# EAGLE design Papra v0.5 (EAGLE 9.6.2)
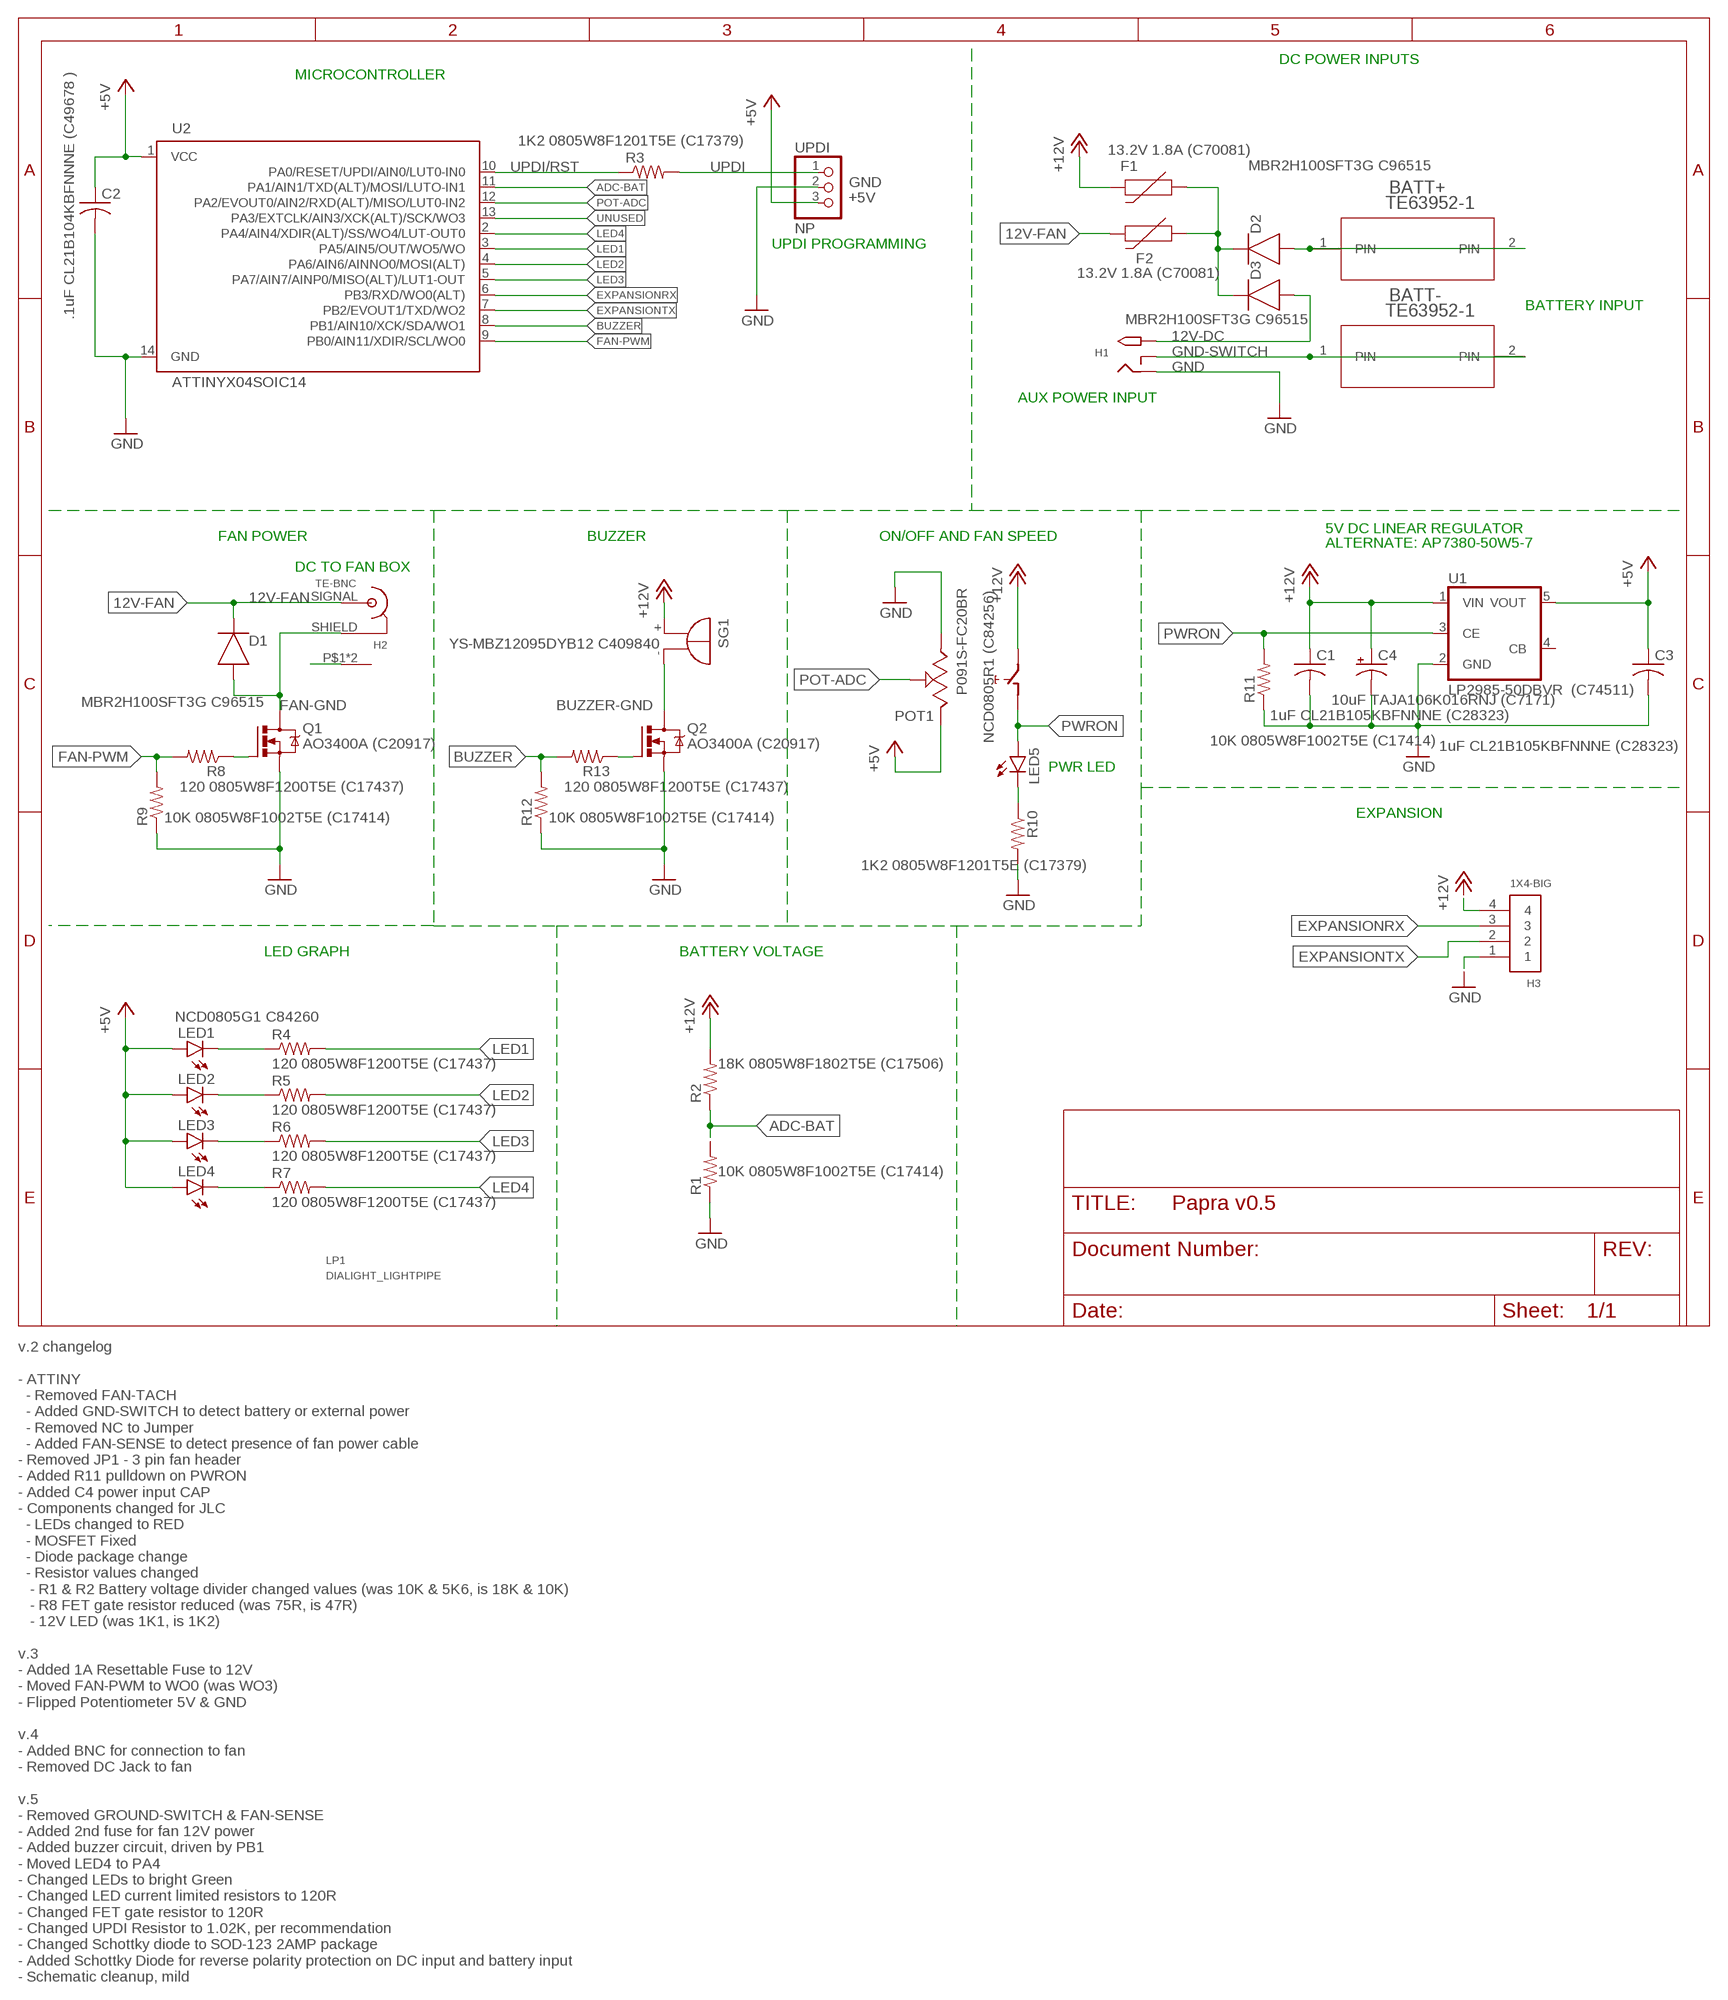
[diagram p0: schematic, sheet 1]

## Parts
BATT+  TE63952-1  [TE63952-1]
BATT-  TE63952-1  [TE63952-1]
C1  1uF CL21B105KBFNNNE (C28323)  C-USC0805  [C0805]
C2  .1uF CL21B104KBFNNNE (C49678 )  C-USC0805  [C0805]
C3  1uF CL21B105KBFNNNE (C28323)  C-USC0805  [C0805]
C4  10uF TAJA106K016RNJ (C7171)  CPOL-USA/3216-18R  [A/3216-18R]
D1  MBR2H100SFT3G C96515  DIODE_DO-219-AB(SOD123F)  [SODFL3718X115]
D2  MBR2H100SFT3G C96515  DIODE_DO-219-AB(SOD123F)  [SODFL3718X115]
D3  MBR2H100SFT3G C96515  DIODE_DO-219-AB(SOD123F)  [SODFL3718X115]
F1  13.2V 1.8A (C70081)  PPTC_HALF-AMP  [1206]
F2  13.2V 1.8A (C70081)  PPTC_HALF-AMP  [1206]
H1  M-CUI-PJ-066A  PJ-066A  [DCJACK-PJ-066A]
H2  TE-BNC  [TE-BNC]
H3  1X4-BIG  [1X04-BIG]
LED1  NCD0805G1 C84260  LEDCHIPLED_0805  [CHIPLED_0805]
LED2  NCD0805G1 C84260  LEDCHIPLED_0805  [CHIPLED_0805]
LED3  NCD0805G1 C84260  LEDCHIPLED_0805  [CHIPLED_0805]
LED4  NCD0805G1 C84260  LEDCHIPLED_0805  [CHIPLED_0805]
LED5  NCD0805R1 (C84256)  LEDCHIPLED_0805  [CHIPLED_0805]
LP1  DIALIGHT_LIGHTPIPE  [DIALIGHT_5151020F_/LEDS]
POT1  P091S-FC20BR  [P091S-FC20BR]
Q1  AO3400A (C20917)  NMOSFET_BSS123-SOT23  [SOT23]
Q2  AO3400A (C20917)  NMOSFET_BSS123-SOT23  [SOT23]
R1  10K 0805W8F1002T5E (C17414)  R-US_R0805  [R0805]
R2  18K 0805W8F1802T5E (C17506)  R-US_R0805  [R0805]
R3  1K2 0805W8F1201T5E (C17379)  R-US_R0805  [R0805]
R4  120 0805W8F1200T5E (C17437)  R-US_R0805  [R0805]
R5  120 0805W8F1200T5E (C17437)  R-US_R0805  [R0805]
R6  120 0805W8F1200T5E (C17437)  R-US_R0805  [R0805]
R7  120 0805W8F1200T5E (C17437)  R-US_R0805  [R0805]
R8  120 0805W8F1200T5E (C17437)  R-US_R0805  [R0805]
R9  10K 0805W8F1002T5E (C17414)  R-US_R0805  [R0805]
R10  1K2 0805W8F1201T5E (C17379)  R-US_R0805  [R0805]
R11  10K 0805W8F1002T5E (C17414)  R-US_R0805  [R0805]
R12  10K 0805W8F1002T5E (C17414)  R-US_R0805  [R0805]
R13  120 0805W8F1200T5E (C17437)  R-US_R0805  [R0805]
SG1  YS-MBZ12095DYB12 C409840  F/TMB  [F/TMB]
U1  LP2985-50DBVR (C74511)  TS520533  [SOT25]
U2  ATTINYX04SOIC14  [SOIC127P600X144-14]
UPDI  NP  PINHD-1X3  [1X03]

## Nets
12V-BAT [RAIL]: BATT+.1(PIN) BATT+.2(PIN) D2.2(A)
12V-DC [RAIL]: D3.2(A) H1.PWR(TIP)
12V-DIODEOR [RAIL]: D2.1(C) D3.1(C) F1.1 F2.1
12V-FAN: D1.1(C) F2.2 H2.SIGNAL(P1)
+5V [RAIL]: C2.1 C3.1 LED1.A LED2.A LED3.A LED4.A POT1.3 U1.5(VOUT) U2.1(VCC) UPDI.3
+12V [RAIL]: C1.1 C4.+ F1.2 H3.4 POT1.NO R2.2 SG1.+ U1.1(VIN)
ADC-BAT: R1.2 R2.1 U2.11(PA1/AIN1/TXD(ALT)/MOSI/LUTO-IN1)
BUZZER: R12.2 R13.2 U2.8(PB1/AIN10/XCK/SDA/WO1)
BUZZER-GND [RAIL]: Q2.3(D) SG1.-
EXPANSIONRX: H3.3 U2.6(PB3/RXD/WO0(ALT))
EXPANSIONTX: H3.2 U2.7(PB2/EVOUT1/TXD/WO2)
FAN-GND [RAIL]: D1.2(A) H2.SHIELD(P2) Q1.3(D)
FAN-PWM: R8.2 R9.2 U2.9(PB0/AIN11/XDIR/SCL/WO0)
FETGATE: Q1.1(G) R8.1
FETGATE1: Q2.1(G) R13.1
GND: C1.2 C2.2 C3.2 C4.- H1.GND(RING) H3.1 POT1.1 Q1.2(S) Q2.2(S) R1.1 R9.1 R10.2 R11.1 R12.1 U1.2(GND) U2.14(GND) UPDI.2
GND-SWITCH: BATT-.1(PIN) BATT-.2(PIN) H1.GNDBREAK(RING_SW)
LED1: R4.2 U2.3(PA5/AIN5/OUT/WO5/WO)
LED1-R: LED1.C R4.1
LED2: R5.2 U2.4(PA6/AIN6/AINNO0/MOSI(ALT))
LED2-R: LED2.C R5.1
LED3: R6.2 U2.5(PA7/AIN7/AINP0/MISO(ALT)/LUT1-OUT)
LED3-R: LED3.C R6.1
LED4: R7.2 U2.2(PA4/AIN4/XDIR(ALT)/SS/WO4/LUT-OUT0)
LED4-R: LED4.C R7.1
LED5-R: LED5.C R10.1
PINS: H2.P$1(P3) H2.P$2(P3)
POT-ADC: POT1.2 U2.12(PA2/EVOUT0/AIN2/RXD(ALT)/MISO/LUT0-IN2)
PWRON: LED5.A POT1.COM R11.2 U1.3(CE)
UNUSED: U2.13(PA3/EXTCLK/AIN3/XCK(ALT)/SCK/WO3)
UPDI: R3.2 UPDI.1
UPDI/RST: R3.1 U2.10(PA0/RESET/UPDI/AIN0/LUT0-IN0)
Unconnected: U1.4(CB)

## Notes on the sheet
- DC POWER INPUTS
- MICROCONTROLLER
- UPDI PROGRAMMING
- BATTERY INPUT
- AUX POWER INPUT
- 5V DC LINEAR REGULATOR
- FAN POWER | BUZZER | ON/OFF AND FAN SPEED
- ALTERNATE: AP7380-50W5-7
- DC TO FAN BOX
- PWR LED
- EXPANSION
- LED GRAPH | BATTERY VOLTAGE
- v.2 changelog
  
  - ATTINY 
    - Removed FAN-TACH
    - Added GND-SWITCH to detect battery or external power
    - Removed NC to Jumper
    - Added FAN-SENSE to detect presence of fan power cable
  - Removed JP1 - 3 pin fan header
  - Added R11 pulldown on PWRON
  - Added C4 power input CAP 
  - Components changed for JLC
    - LEDs changed to RED
    - MOSFET Fixed
    - Diode package change
    - Resistor values changed
     - R1 & R2 Battery voltage divider changed values (was 10K & 5K6, is 18K & 10K)
     - R8 FET gate resistor reduced (was 75R, is 47R)
     - 12V LED (was 1K1, is 1K2)
  
  v.3
  - Added 1A Resettable Fuse to 12V
  - Moved FAN-PWM to WO0 (was WO3)
  - Flipped Potentiometer 5V & GND
  
  v.4 
  - Added BNC for connection to fan
  - Removed DC Jack to fan
  
  v.5
  - Removed GROUND-SWITCH & FAN-SENSE
  - Added 2nd fuse for fan 12V power
  - Added buzzer circuit, driven by PB1
  - Moved LED4 to PA4
  - Changed LEDs to bright Green
  - Changed LED current limited resistors to 120R
  - Changed FET gate resistor to 120R
  - Changed UPDI Resistor to 1.02K, per recommendation
  - Changed Schottky diode to SOD-123 2AMP package
  - Added Schottky Diode for reverse polarity protection on DC input and battery input
  - Schematic cleanup, mild

## Library data of the parts
BATT+ BATT- = PC-LIB:TE63952-1
C1-C3 = rcl:C-US: CAPACITOR, American symbol; SPICEPREFIX: C
C4 = rcl:CPOL-US: POLARIZED CAPACITOR, American symbol; SPICEPREFIX: C
D1-D3 = Diode:DIODE: Diode Rectifier - Generic; CATEGORY: Diode; SUB-CATEGORY: Rectifier; VALUE: DIODE
F1 F2 = SparkFun-Fuses:PPTC: Resettable Fuse PPTC Resettable Fuse. Really a sort of resistor with a polymeric positive temperature coefficient whose resistance increases dramatically with an increase in temperature. When heated by the power passing through the resistance rises causing the current to be limited, protecting the circuit. This is achieved by the transition of the polymer from a crystalline to an amorphous state where the conductive carbon separates breaking the conductive pathways found in the cool crystalline structure. When a PPTC cools back down it resumes conducting letting the circuit turn back on. SparkFun Products: SparkFun RedBoard - Programmed with Arduino <https://www.sparkfun.com/products/12757> Pro Micro - 5V/16MHz <https://www.sparkfun.com/products/12640> Arduino Pro 328 - 5V/16MHz <https://www.sparkfun.com/products/10915> MP3 Trigger <https://www.sparkfun.com/products/13720>; PROD_ID: RES-08585; VALUE: 6V/0.5A
H1 = PC-LIB:PJ-066A
H2 = PC-LIB:TE-BNC: https://www.te.com/usa-en/product-1-1478032-0.html
H3 = adafruit:1X4: 4-pin connector
LED1-LED5 = led:LED: LED OSRAM: - CHIPLED LG R971, LG N971, LY N971, LG Q971, LY Q971, LO R971, LY R971 LH N974, LH R974 LS Q976, LO Q976, LY Q976 LO Q996 - Hyper CHIPLED LW Q18S LB Q993, LB Q99A, LB R99A - SideLED LS A670, LO A670, LY A670, LG A670, LP A670 LB A673, LV A673, LT A673, LW A673 LH A674 LY A675 LS A676, LA A676, LO A676, LY A676, LW A676 LS A679, LY A679, LG A679 - Hyper Micro SIDELED® LS Y876, LA Y876, LO Y876, LY Y876 LT Y87S - SmartLED LW L88C, LW L88S LB L89C, LB L89S, LG L890 LS L89K, LO L89K, LY L89K LS L896, LA L896, LO L896, LY L896 - TOPLED LS T670, LO T670, LY T670, LG T670, LP T670 LSG T670, LSP T670, LSY T670, LOP T670, LYG T670 LG T671, LOG T671, LSG T671 LB T673, LV T673, LT T673, LW T673 LH T674 LS T676, LA T676, LO T676, LY T676, LB T676, LH T676, LSB T676, LW T676 LB T67C, LV T67C, LT T67C, LS T67K, LO T67K, LY T67K, LW E67C LS E67B, LA E67B, LO E67B, LY E67B, LB E67C, LV E67C, LT E67C LW T67C LS T679, LY T679, LG T679 LS T770, LO T770, LY T770, LG T770, LP T770 LB T773, LV T773, LT T773, LW T773 LH T774 LS E675, LA E675, LY E675, LS T675 LS T776, LA T776, LO T776, LY T776, LB T776 LHGB T686 LT T68C, LB T68C - Hyper Mini TOPLED® LB M676 - Mini TOPLED Santana® LG M470 LS M47K, LO M47K, LY M47K Source: http://www.osram.convergy.de LUXEON: - LUMILED® LXK2-PW12-R00, LXK2-PW12-S00, LXK2-PW14-U00, LXK2-PW14-V00 LXK2-PM12-R00, LXK2-PM12-S00, LXK2-PM14-U00 LXK2-PE12-Q00, LXK2-PE12-R00, LXK2-PE12-S00, LXK2-PE14-T00, LXK2-PE14-U00 LXK2-PB12-K00, LXK2-PB12-L00, LXK2-PB12-M00, LXK2-PB14-N00, LXK2-PB14-P00, LXK2-PB14-Q00 LXK2-PR12-L00, LXK2-PR12-M00, LXK2-PR14-Q00, LXK2-PR14-R00 LXK2-PD12-Q00, LXK2-PD12-R00, LXK2-PD12-S00 LXK2-PH12-R00, LXK2-PH12-S00 LXK2-PL12-P00, LXK2-PL12-Q00, LXK2-PL12-R00 Source: www.luxeon.com KINGBRIGHT: KA-3528ASYC Source: www.kingbright.com
LP1 = PC-LIB:DIALIGHT_LIGHTPIPE: DIALIGHT QUAD LIGHTPIPE 515-1020 WITH 0805LEDS
POT1 = PC-LIB:P091S-FC20BR: TT P091S-FC20BR10K
Q1 Q2 = Transistor:NMOSFET_: N-Channel MOSFET - Popular parts; CATEGORY: Transistor; DESCRIPTION: MOSFET N-CH 100V 0.17A SOT-23; DRAIN_CURRENT: 170mA; MANUFACTURER: ON Semiconductor; MPN: BSS123L; OPERATING_TEMP: -55°C ~ 150°C; PART_STATUS: Active; ROHS_COMPLIANT: Yes; SUB-CATEGORY: MOSFET; THERMALLOSS: 360mW; TYPE: N-Channel; VALUE: BSS123
R1-R13 = rcl:R-US_: RESISTOR, American symbol; SPICEPREFIX: R
SG1 = buzzer:F/TMB: BUZZER Source: Buerklin; OC_FARNELL: unknown; OC_NEWARK: unknown
U1 = v-reg:TS5205: 150mA Low Noise LDO Voltage Regulator with Enable TSC [Taiwan Semiconductor Company, Ltd] Source: http://www.taiwansemi.com .. 5205_0409c.pdf
U2 = PC-LIB:ATTINYX04
UPDI = adafruit:PINHD-1X3: PIN HEADER

## Net classes
0 default: width 0.254 mm, clearance 0.203 mm
1 RAIL: width 0.508 mm, clearance 0.254 mm

## Board
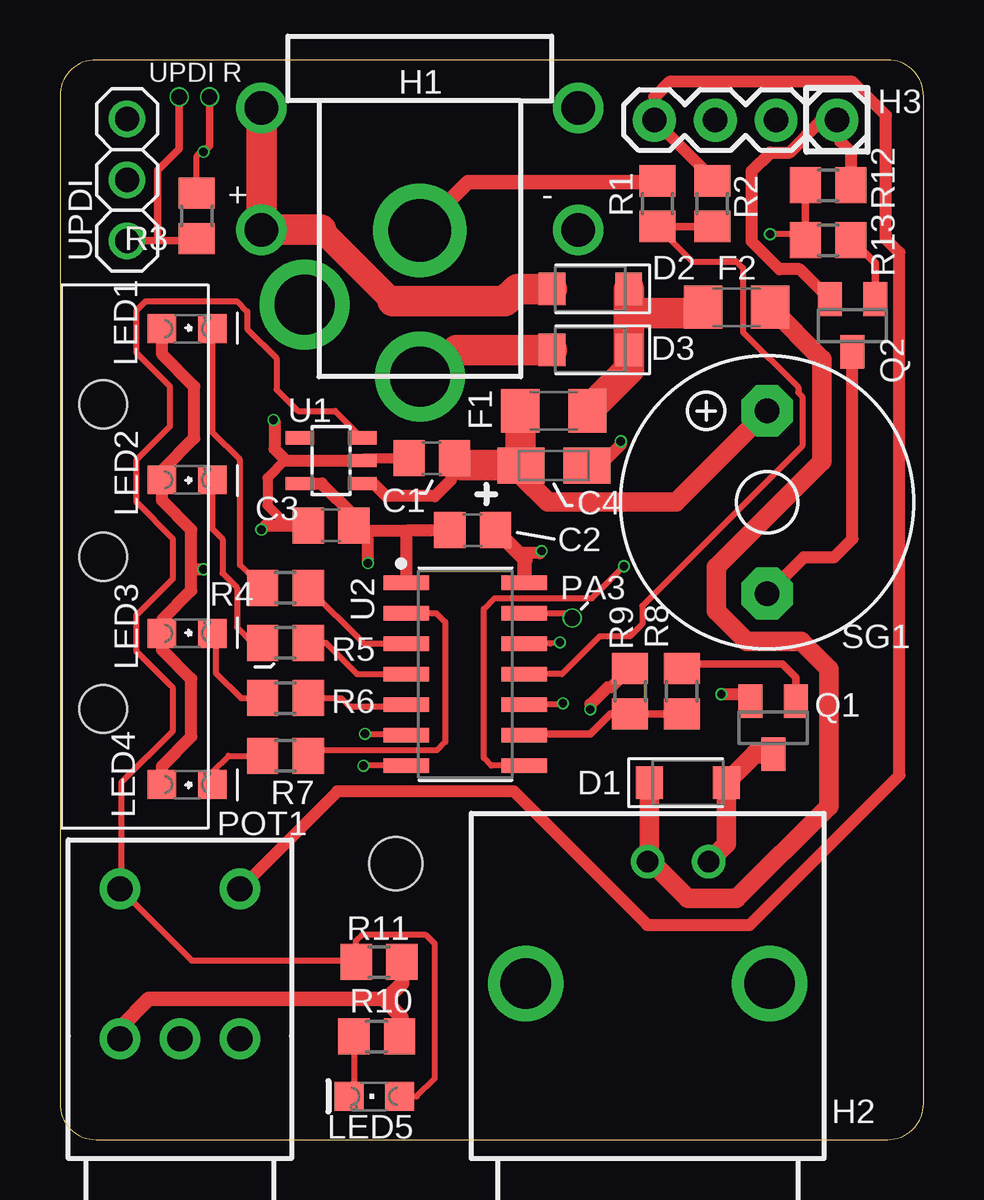
[diagram p1: board, top side]
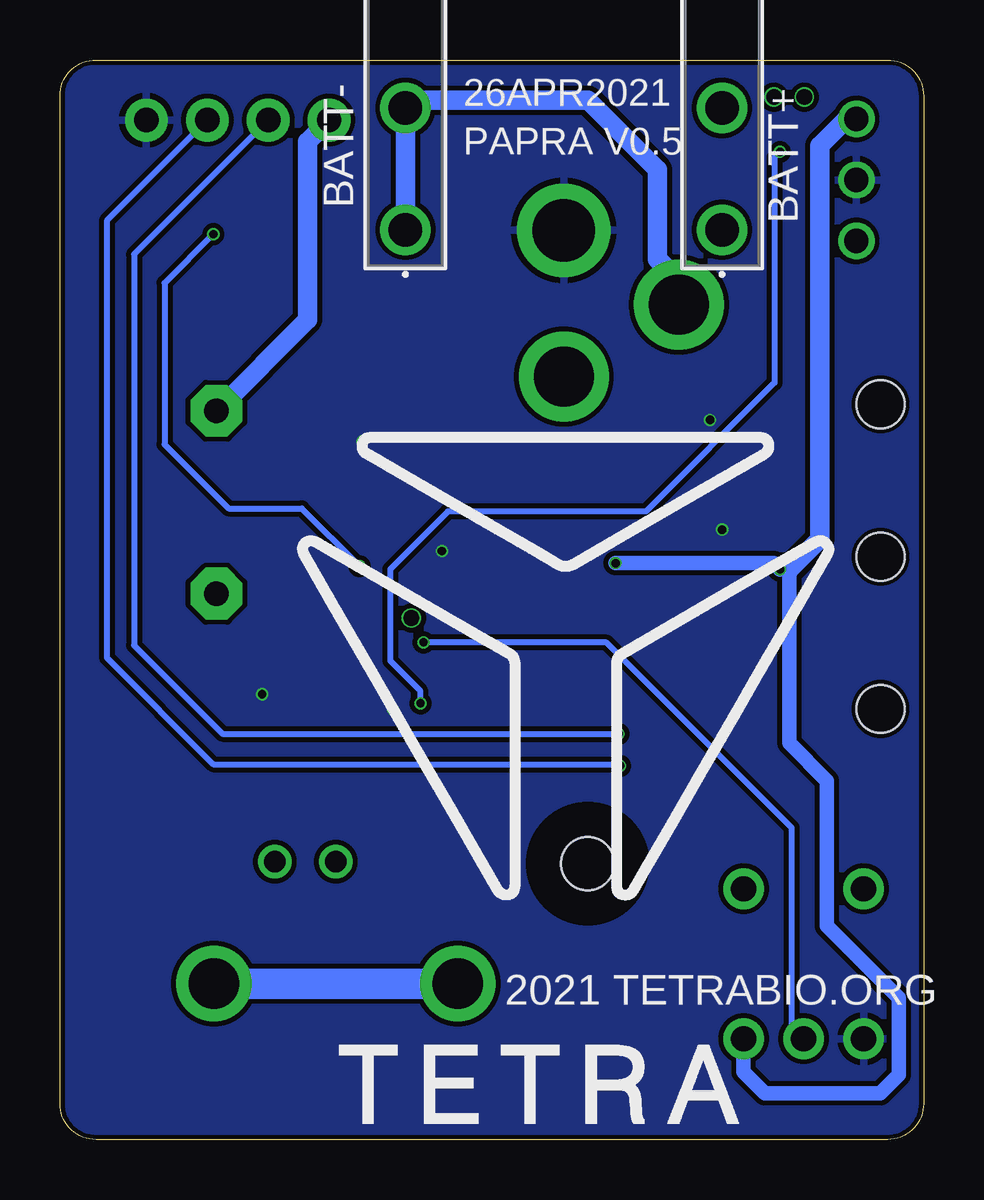
[diagram p2: board, bottom side, seen from below]

Size 36 x 45 mm. Coordinates in mm from the lower left corner, seen from the top.
Outline: 34.5,45 1.5,45 arc90 0,43.5 0,1.5 arc90 1.5,0 34.5,0 arc90 36,1.5 36,43.5 arc90 34.5,45
Copper layers (1*16): Top 0.035mm / dielectric 1.6mm / Bottom 0.035mm
Design rules "jlcpcb-2layers": minimum track width 5mil, minimum drill 0.3mm, track to track 5mil, track to pad 5mil, pad to pad 5mil, via to via 5mil, smd to smd 5mil, copper to edge 0.2mm, drill to drill 6mil, minimum pad ring 10mil, minimum via ring 3mil, stop-mask expansion 4mil, vias tented up to drill 0mil, thermal gap 10mil
Holes 2.2 mm at 14,11.5
bRestrict: area 11.5,9 to 16.5,14

### Footprints (pad centres in the part's own frame; a part is rotated, then mirrored left to right if it is on the bottom)
TE63952-1 = drill 1.397 pad 1.905: 1 -2.54,0; 2 2.54,0
C0805 = smd 1.3 x 1.5: 1 -0.95,0; 2 0.95,0
A/3216-18R = smd 1.95 x 1.5: + 1.375,0; - -1.375,0
SODFL3718X115 = smd 1.115 x 1.361: 1 -1.6,0; 2 1.6,0
1206 = smd 1.6 x 1.8: 1 -1.4,0; 2 1.4,0
DCJACK-PJ-066A = drill 2.6: GND 0,8.1 | drill 2.5: GNDBREAK 4.8,11.2; PWR 0,14.2
TE-BNC = drill 2.1: P$1 -7.3,5.08; P$2 -7.3,-5.08 | drill 0.89: SHIELD -12.38,2.54; SIGNAL -12.38,0
1X04-BIG = drill 1.016 pad 1.778: 1 0,0; 2 2.54,0; 3 5.08,0; 4 7.62,0
CHIPLED_0805 = smd 1.2 x 1.2: A 0,-1.05; C 0,1.05
DIALIGHT_5151020F_/LEDS = hole 2: 0,0; 6.35,0; -6.35,0
P091S-FC20BR = drill 1.05 pad 1.7: 1 -5,-2.5; 2 -5,0; 3 -5,2.5; COM -11.25,-2.5; NO -11.25,2.5
SOT23 = smd 1 x 1.4: 1 -0.95,-1.1; 2 0.95,-1.1; 3 0,1.1
R0805 = smd 1.3 x 1.5: 1 -0.95,0; 2 0.95,0
F/TMB = drill 1.016 pad 2.159 octagon: + 3.81,0; - -3.81,0
SOT25 = smd 0.55 x 1.2: 1 -0.95,-1.3; 2 0,-1.3; 3 0.95,-1.3; 4 0.95,1.3; 5 -0.95,1.3
SOIC127P600X144-14 = smd 1.901 x 0.599: 1 -2.455,3.81; 2 -2.455,2.54; 3 -2.455,1.27; 4 -2.455,0; 5 -2.455,-1.27; 6 -2.455,-2.54; 7 -2.455,-3.81; 8 2.455,-3.81; 9 2.455,-2.54; 10 2.455,-1.27; 11 2.455,0; 12 2.455,1.27; 13 2.455,2.54; 14 2.455,3.81
1X03 = drill 1.016: 1 -2.54,0; 2 0,0; 3 2.54,0

### Placement (x,y rotation side)
BATT+  8.4,40.46 90 bottom
BATT-  21.6,40.46 90 bottom
C1  15.5,28.4 180 top
C2  17.2,25.4 0 top
C3  11.3,25.6 180 top
C4  20.59,28.09 180 top
D1  26.18,14.88 0 top
D2  22.11,35.45 180 top
D3  22.11,32.91 180 top
F1  20.59,30.37 180 top
F2  28.21,34.69 0 top
H1  15,46 180 top
H2  24.5,-0.8 270 top
H3  32.4,42.49 180 top
LED1  5.3,33.8 270 top
LED2  5.3,27.5 270 top
LED3  5.3,21.1 270 top
LED4  5.3,14.8 270 top
LED5  13.1,1.8 90 top
LP1  1.8,24.3 270 top
POT1  5,-0.8 270 top
Q1  29.73,17.17 180 top
Q2  33.03,33.93 180 top
R1  24.91,39.01 270 top
R2  27.19,39.01 90 top
R3  5.7,38.5 270 top
R4  9.4,23 0 top
R5  9.4,20.7 0 top
R6  9.4,18.4 0 top
R7  9.4,16 0 top
R8  25.92,18.69 270 top
R9  23.76,18.69 270 top
R10  13.2,4.3 0 top
R11  13.3,7.4 180 top
R12  32.02,39.77 180 top
R13  32.02,37.49 180 top
SG1  29.48,26.56 90 top
U1  11.3,28.3 90 top
U2  16.9,19.4 0 top
UPDI  2.8,40 90 top

### Tracks (layer width: path | path; a pad name or v marks a point on that pad's centre or on a via)
12V-BAT
  Top 1.016: 10.88,37.92 13.86,34.95
  Top 1.27: BATT+.2 BATT+.1 10.88,37.92 | D2.2 19.06,35.45 18.56,34.95 13.86,34.95
12V-DC
  Top 1.27: H1.PWR 15.41,31.8 16.52,32.91 D3.2
12V-DIODEOR
  Top 1.27: D2.1 23.71,34.44 | 23.71,34.44 23.71,33.55 D3.1 23.71,32.1 F1.1 | F2.1 26.55,34.44 23.71,34.44
12V-FAN
  Top 0.813: D1.1 24.58,11.66 | 24.58,11.66 H2.SIGNAL | F2.2 31.76,32.54 31.76,28.26 27.36,23.86 27.36,22.03 28.63,20.76 30.9,20.76 32.05,19.61 32.05,13.89 28.21,10.05 26.18,10.05 24.58,11.66
+5V  (via drill 0.35)
  Top 0.508: C3.1 12.47,25.38 14.49,25.38 | C2.1 14.51,25.4 14.49,25.38 | U2.1 14.45,25.33 14.49,25.38 | U1.5 10.91,27.35 12.25,26.01 C3.1 | LED4.A 4.25,15.56 5.47,16.79 5.47,19.2 4.25,20.42 LED3.A 4.25,21.66 5.47,22.88 5.47,23.77 | 5.47,23.77 5.47,25.42 4.25,26.65 LED2.A 4.25,27.88 5.6,29.23 5.6,31.39 4.25,32.74 LED1.A | v12.84,24.02 12.84,25.01 C3.1 | v5.98,23.77 5.47,23.77
  Bottom 0.508: v5.98,23.77 5.6,23.77
  Bottom 0.61: 5.6,23.77 5.6,16.53 4.02,14.95 4.02,8.9 1.03,5.91 1.03,2.69 1.79,1.93 6.62,1.93 7.51,2.82 POT1.3 | v5.98,23.77 6.24,24.02 v12.84,24.02
  Bottom 0.813: 5.6,23.77 4.33,25.04 4.33,41.42 3.21,42.54 UPDI.3
+12V
  Top 0.508: U1.1 13.07,27.35 13.6,26.82 15.63,26.82 16.3,27.48 16.3,28.25 C1.1 | R2.2 27.19,40.08 H3.4 24.78,43.46 25.41,44.09 33.03,44.09 34.43,42.69 34.43,37.53 34.99,36.97 34.99,15.19 28.75,8.95 24.49,8.95 18.92,14.51 11.56,14.51 POT1.NO
  Top 0.813: SG1.+ 25.67,26.56 20.33,26.56 19.21,27.68 C4.+
  Top 1.27: F1.2 19.19,28.11 | 19.19,28.11 C4.+ | C1.1 16.74,28.11 19.19,28.11
  Bottom 0.813: H3.4 25.67,41.6 25.67,34.18 SG1.+
ADC-BAT
  Top 0.254: R1.2 26.37,36.6 28.21,36.6 28.48,36.33 28.48,33.66 30.77,31.36 30.77,31.14 30.94,30.98 30.94,28.91 24.27,22.25 24.27,21.48 23.76,20.98 22.49,20.98 20.92,19.4 U2.11
  Top 0.305: R1.2 R2.1
BUZZER  (via drill 0.35)
  Top 0.254: R13.2 30.81,37.74 v29.61,37.74 | U2.8 17.97,15.59 17.67,15.9 17.67,22.12 18.12,22.57 22.18,22.57 v23.51,23.9
  Top 0.305: R12.2 R13.2
  Bottom 0.254: v29.61,37.74 31.64,35.71 31.64,28.98 28.97,26.31 25.92,26.31 v23.51,23.9
BUZZER-GND
  Top 0.508: SG1.- 31,24.28 32.27,24.28 33.03,25.04 Q2.3
EXPANSIONRX  (via drill 0.35)
  Top 0.254: v12.71,16.91 14.39,16.91 U2.6
  Bottom 0.254: H3.3 32.91,36.91 32.91,20.59 29.22,16.91 v12.71,16.91
EXPANSIONTX  (via drill 0.35)
  Top 0.254: U2.7 12.77,15.59 12.71,15.64 v12.65,15.58
  Bottom 0.254: H3.2 34.05,38.3 34.05,20.09 29.61,15.64 12.71,15.64 v12.65,15.58
FAN-GND
  Top 0.813: H2.SHIELD 27.78,12.32 D1.2 28.96,16.07 Q1.3
FAN-PWM
  Top 0.305: U2.9 19.41,16.91 22.11,16.91 22.94,17.74 R9.2 R8.2
FETGATE
  Top 0.305: R8.1 26.12,19.83 30.11,19.83 30.68,19.26 Q1.1
FETGATE1
  Top 0.305: R13.1 33.03,37.49 33.98,36.54 Q2.1
GND  (via drill 0.35)
  Top 0.254: 14.25,4.4 R10.2
  Top 0.406: C1.2 12.7,28.4 U1.2 9.37,28.3 8.65,27.58 8.65,26.44 9.49,25.6 C3.2
  Top 0.508: R12.1 32.97,41.17 32.53,41.61 32.53,42.36 H3.1 31.76,42.49 30.42,41.15 29.61,41.15 28.84,40.38 28.84,37.43 29.99,36.28 30.84,36.28 Q2.2 | v20.08,24.53 19.99,24.45 19.1,24.45 | v8.4,25.42 8.57,25.6 C3.2 | v8.9,29.99 8.94,29.95 8.94,28.79 9.43,28.3 U1.2 | v27.57,18.56 28.48,18.56 Q1.2 | R9.1 22.97,18.85 22.82,18.85 22.11,18.14 v22.11,17.93 | C4.- 22.08,28.2 22.62,28.2 23.38,28.97 v23.38,29.1
  Top 0.61: R1.1 24.85,39.9 17,39.9 H1.GND | POT1.1 2.5,4.67 3.7,5.86 13.48,5.86 | 13.48,5.86 13.6,5.86 14.25,6.51 R11.1 | 14.25,4.4 14.25,5.09 13.48,5.86 | C2.2 19.1,24.45 19.4,24.15 19.36,24.11 U2.14
  pour Bottom: 37.35,46.5 -1,46.5 -1,-1.5 37.35,-1.5
GND-SWITCH
  Bottom 0.813: BATT-.1 BATT-.2 21.27,43.33 13.98,43.33 11.09,40.43 11.09,36.7 10.2,35.82 H1.GNDBREAK
LED1
  Top 0.254: R4.2 12.68,20.67 U2.3
LED1-R
  Top 0.254: R4.1 7.51,23.94 7.51,28.34 6.35,29.5 LED1.C
LED2
  Top 0.254: R5.2 11.09,20.7 12.38,19.4 U2.4
LED2-R
  Top 0.254: LED2.C 6.35,25.47 6.78,25.04 6.78,23.61 7.38,23.01 7.38,21.36 8.04,20.7 R5.1
LED3
  Top 0.254: R6.2 11.73,18.4 12.08,18.05 14.37,18.05 U2.5
LED3-R
  Top 0.254: LED3.C 6.49,20.96 6.49,19.45 7.54,18.4 R6.1
LED4
  Top 0.254: R7.2 10.57,16.23 15.71,16.23 16.05,16.57 16.05,21.57 15.69,21.94 U2.2
LED4-R
  Top 0.254: LED4.C 6.35,15.32 7.03,16 R7.1
LED5-R
  Top 0.254: R10.1 12.25,2 LED5.C
PINS
  Bottom 1.27: H2.P$2 H2.P$1
POT-ADC  (via drill 0.35)
  Top 0.254: v20.84,20.72 20.43,20.67 U2.12
  Bottom 0.254: POT1.2 5.51,4.71 5.51,13.01 13.22,20.72 v20.84,20.72
PWRON
  Top 0.254: LED5.A 14.87,1.8 15.63,2.56 15.63,8.15 15.25,8.53 12.59,8.53 12.33,8.28 12.33,7.42 | 12.33,7.42 R11.2 | U1.3 11.48,30.37 9.92,30.37 9.03,31.26 9.03,32.56 7.81,33.79 7.81,34.52 7.38,34.95 3.57,34.95 3.19,34.56 3.19,32.79 4.59,31.39 4.59,29.74 3.19,28.34 3.19,26.56 4.71,25.04 4.71,23.39 3.19,21.86 3.19,20.34 4.71,18.82 4.71,17.04 2.55,14.88 2.55,10.5 POT1.COM 5.48,7.47 12.28,7.47 12.33,7.42
UNUSED  (via drill 0.65)
  Top 0.254: U2.13 21.15,21.94 v21.35,21.74
UPDI  (via drill 0.65)
  Top 0.305: UPDI.1 4.08,37.46 | 4.08,37.46 5.61,37.46 R3.2 | v4.97,43.45 4.97,41.3 4.08,40.41 4.08,37.46
UPDI/RST  (via drill 0.35, 0.65)
  Top 0.254: R3.1 5.7,41.01 5.86,41.17 v5.98,41.17 | v20.97,18.18 20.92,18.13 U2.10
  Top 0.305: v5.98,41.17 6.24,41.42 v6.24,43.45
  Bottom 0.254: v5.98,41.17 6.21,40.94 6.21,31.55 11.57,26.18 19.83,26.18 22.24,23.77 22.24,19.96 20.97,18.69 v20.97,18.18

### Text on the board
tPlace: UPDI R | PA3
bPlace: 26APR2021 | PAPRA V0.5 | 2021 TETRABIO.ORG
tNames: + | -
Document: v.2 changelog / / - BATTERY Tabs swapped (polarity, same position) / - SMT Components Moved, won't affect mechanical / - D1 package changed (was SMB, is SMA) / / v.3 changelog (see schematic for signal changes) / / - Added mounting hole / - Added fuse, moved SMT components to fit / - Adjustments for JLC DRU, pad override was 40%, reduced to 25% / - Silk cleanup / - Changed Battery Tab package to round pads (was square) / / v.4 / - Board is 2mm wider on right side / - DC power out is now BNC / / v.5 / - Board is wider on right side / - Added Buzzer and circuitry to drive buzzer / - Adjusted placment of parts to add buzzer and uncrowd region / - Rotated H3 / - Grounded isolated pins on BNC
200bmp: C:/Users/pc/Downloads/Tetra Logo Package/tetra.bmp